# EAGLE schematic 7segroganti (EAGLE 6.6.0)
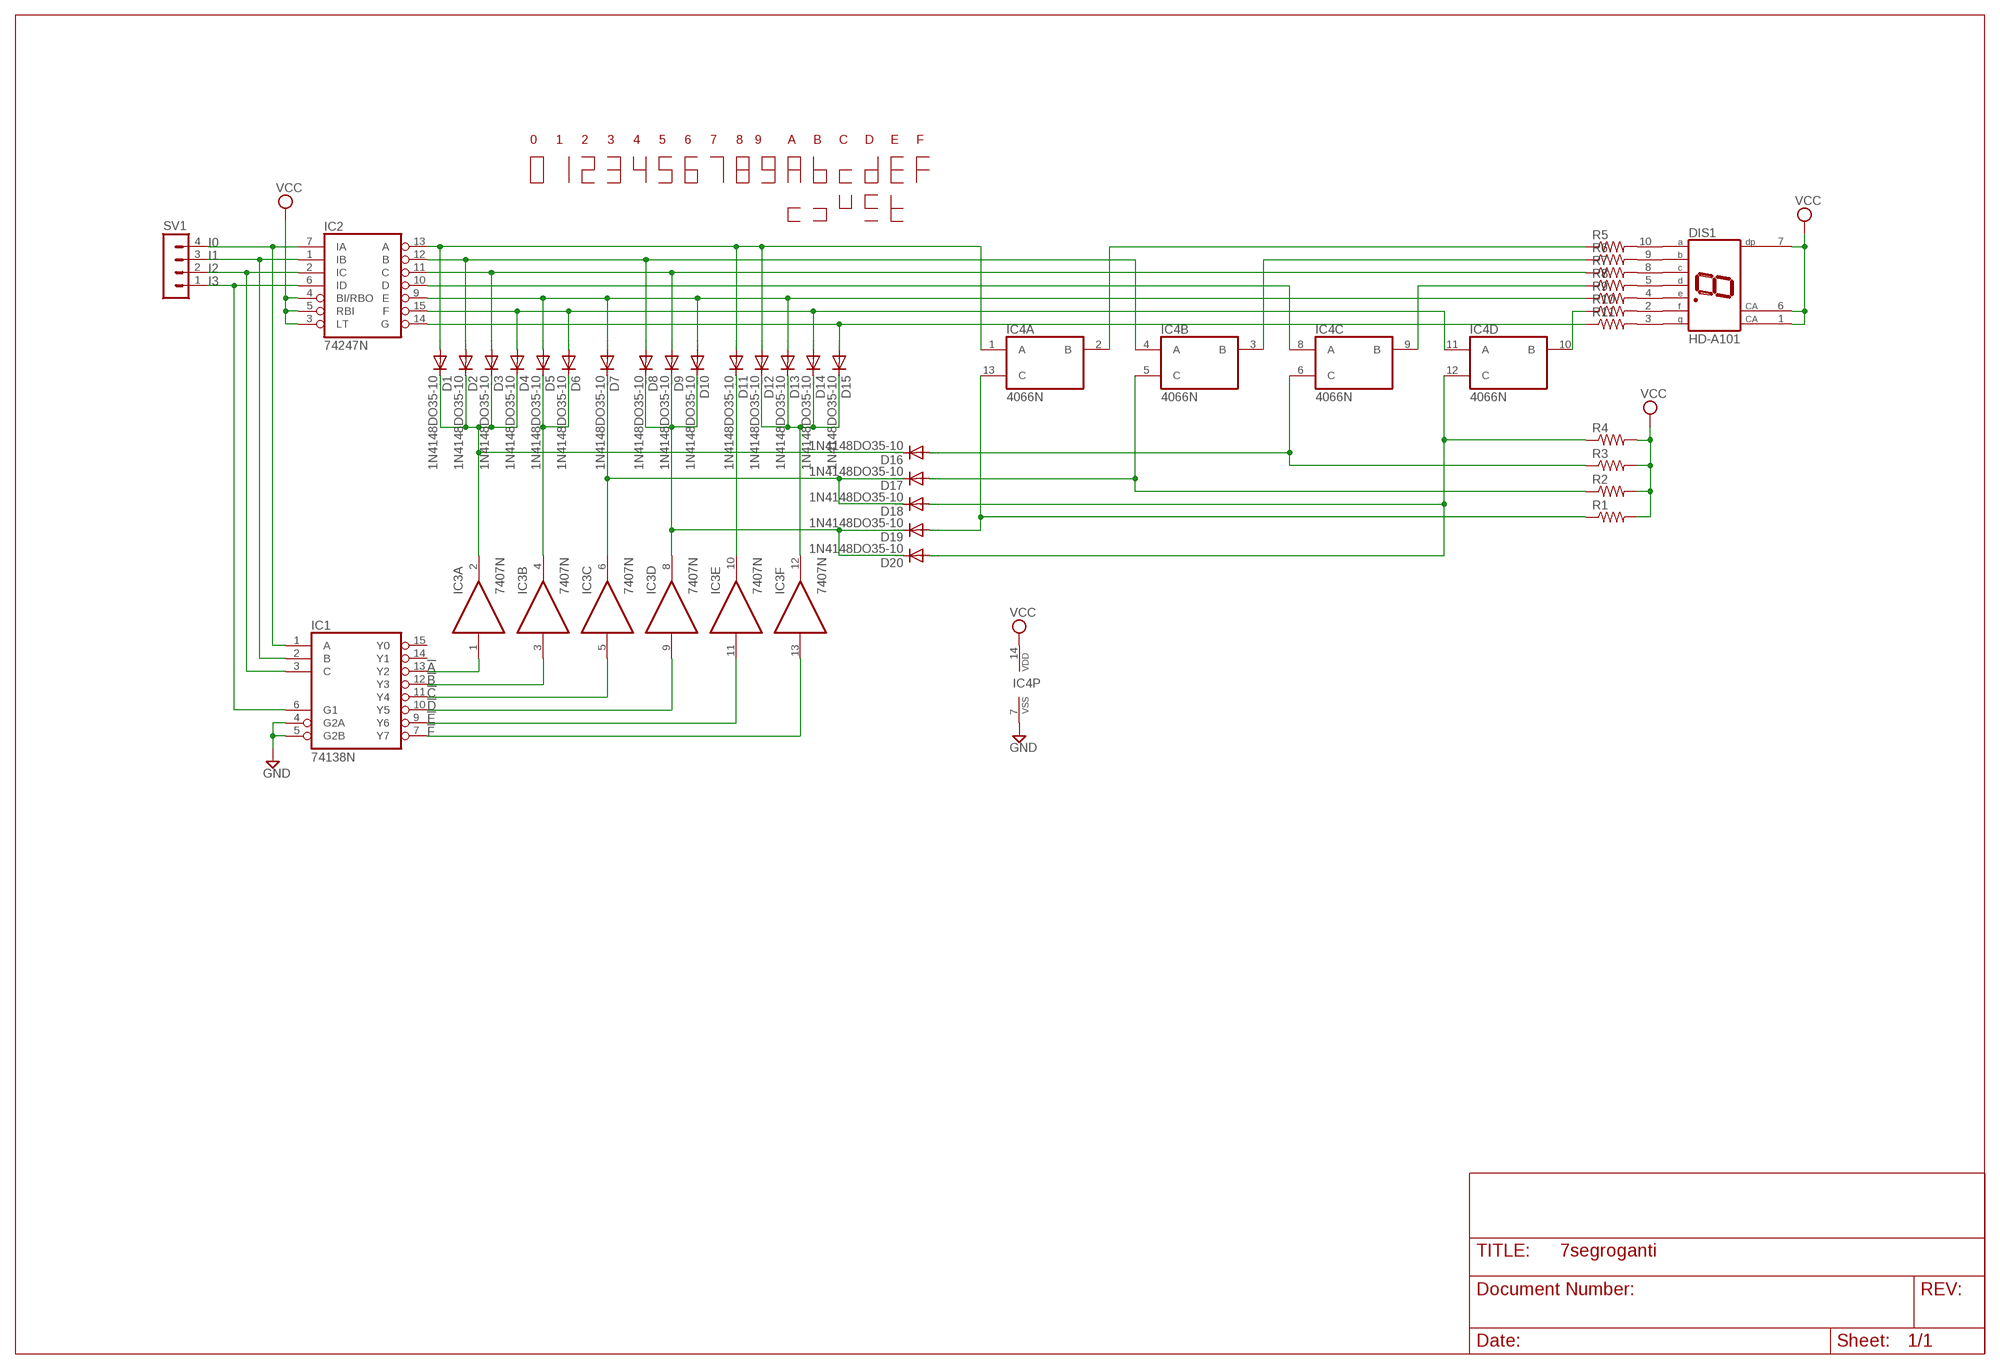
[diagram p0: schematic, sheet 1]

## Parts
D1  1N4148DO35-10  [DO35-10]
D2  1N4148DO35-10  [DO35-10]
D3  1N4148DO35-10  [DO35-10]
D4  1N4148DO35-10  [DO35-10]
D5  1N4148DO35-10  [DO35-10]
D6  1N4148DO35-10  [DO35-10]
D7  1N4148DO35-10  [DO35-10]
D8  1N4148DO35-10  [DO35-10]
D9  1N4148DO35-10  [DO35-10]
D10  1N4148DO35-10  [DO35-10]
D11  1N4148DO35-10  [DO35-10]
D12  1N4148DO35-10  [DO35-10]
D13  1N4148DO35-10  [DO35-10]
D14  1N4148DO35-10  [DO35-10]
D15  1N4148DO35-10  [DO35-10]
D16  1N4148DO35-10  [DO35-10]
D17  1N4148DO35-10  [DO35-10]
D18  1N4148DO35-10  [DO35-10]
D19  1N4148DO35-10  [DO35-10]
D20  1N4148DO35-10  [DO35-10]
DIS1  HD-A101  [HDSP-A]
IC1  74138N  74S138N  [DIL16]
IC2  74247N  7446N  [DIL16]
IC3  7407N  [DIL14]
IC4  4066N  [DIL14]
R1  R-US_0207/10  [0207/10]
R2  R-US_0207/10  [0207/10]
R3  R-US_0207/10  [0207/10]
R4  R-US_0207/10  [0207/10]
R5  R-US_0207/10  [0207/10]
R6  R-US_0207/10  [0207/10]
R7  R-US_0207/10  [0207/10]
R8  R-US_0207/10  [0207/10]
R9  R-US_0207/10  [0207/10]
R10  R-US_0207/10  [0207/10]
R11  R-US_0207/10  [0207/10]
SV1  MA04-1  [MA04-1]

## Nets
!A: IC1.13(Y2) IC3.1(A:I)
!B: IC1.12(Y3) IC3.3(B:I)
!C: IC1.11(Y4) IC3.5(C:I)
!D: IC1.10(Y5) IC3.9(D:I)
!E: IC1.9(Y6) IC3.11(E:I)
!F: IC1.7(Y7) IC3.13(F:I)
GND: IC1.4(G2A) IC1.5(G2B) IC4.7(P:VSS)
I0: IC1.1(A) IC2.7(IA) SV1.4
I1: IC1.2(B) IC2.1(IB) SV1.3
I2: IC1.3(C) IC2.2(IC) SV1.2
I3: IC1.6(G1) IC2.6(ID) SV1.1
N$1: DIS1.10(A) R5.2
N$2: IC4.2(A:B) R5.1
N$3: IC4.3(B:B) R6.1
N$4: D1.A D11.A D12.A IC2.13(A) IC4.1(A:A)
N$5: DIS1.2(F) R10.2
N$6: D3.A D9.A IC2.11(C) R7.1
N$7: IC2.10(D) IC4.8(C:A)
N$8: D5.A D7.A D10.A D13.A IC2.9(E) R9.1
N$9: D4.A D6.A D14.A IC2.15(F) IC4.11(D:A)
N$10: D15.A IC2.14(G) R11.1
N$11: D2.A D8.A IC2.12(B) IC4.4(B:A)
N$12: D1.C D2.C D3.C D4.C D16.C IC3.2(A:O)
N$13: D5.C D6.C IC3.4(B:O)
N$14: D7.C D17.C D18.C IC3.6(C:O)
N$15: D8.C D9.C D10.C D19.C D20.C IC3.8(D:O)
N$16: D11.C IC3.10(E:O)
N$17: D12.C D13.C D14.C D15.C IC3.12(F:O)
N$18: DIS1.9(B) R6.2
N$19: DIS1.8(C) R7.2
N$20: DIS1.5(D) R8.2
N$21: DIS1.4(E) R9.2
N$22: DIS1.3(G) R11.2
N$23: D18.A D20.A IC4.12(D:C) R4.1
N$24: IC4.10(D:B) R10.1
N$25: IC4.9(C:B) R8.1
N$26: D16.A IC4.6(C:C) R3.1
N$27: D17.A IC4.5(B:C) R2.1
N$28: D19.A IC4.13(A:C) R1.1
VCC: DIS1.1(CA) DIS1.6(CA) DIS1.7(DP) IC2.3(LT) IC2.4(BI/RBO) IC2.5(RBI) IC4.14(P:VDD) R1.2 R2.2 R3.2 R4.2
Unconnected: IC1.14(Y1) IC1.15(Y0)

## Notes on the sheet
- 0 | 1 | 2 | 3 | 4 | 5 | 6 | 7 | 8 | 9 | A | B | C | D | E | F

## Power pins joined to a net without a drawn wire
GND: IC1.8(GND) IC2.8(GND) IC3.7(P:GND)
VCC: IC1.16(VCC) IC2.16(VCC) IC3.14(P:VCC)

## Library data of the parts
D1-D20 = diode:1N4148: DIODE high speed (Philips)
DIS1 = display-hp:HD-A101: LED DISPLAY 1-character 7 segment, decimal point right; OC_FARNELL: unknown; OC_NEWARK: unknown
IC1 = 74xx-us:74*138: 3-line to 8-line DECODER/DEMULTIPLEXER
IC2 = 74xx-us:74*46: BCD to seven segment DECODER/DRIVER, open collector
IC3 = 74xx-us:74*07: Hex BUFFER, open collector high-voltage output
IC4 = 40xx:4066: Quad bilateral ANALOG SWITCH
R1-R11 = rcl:R-US_: RESISTOR, American symbol
SV1 = con-lstb:MA04-1: PIN HEADER; OC_FARNELL: unknown; OC_NEWARK: unknown